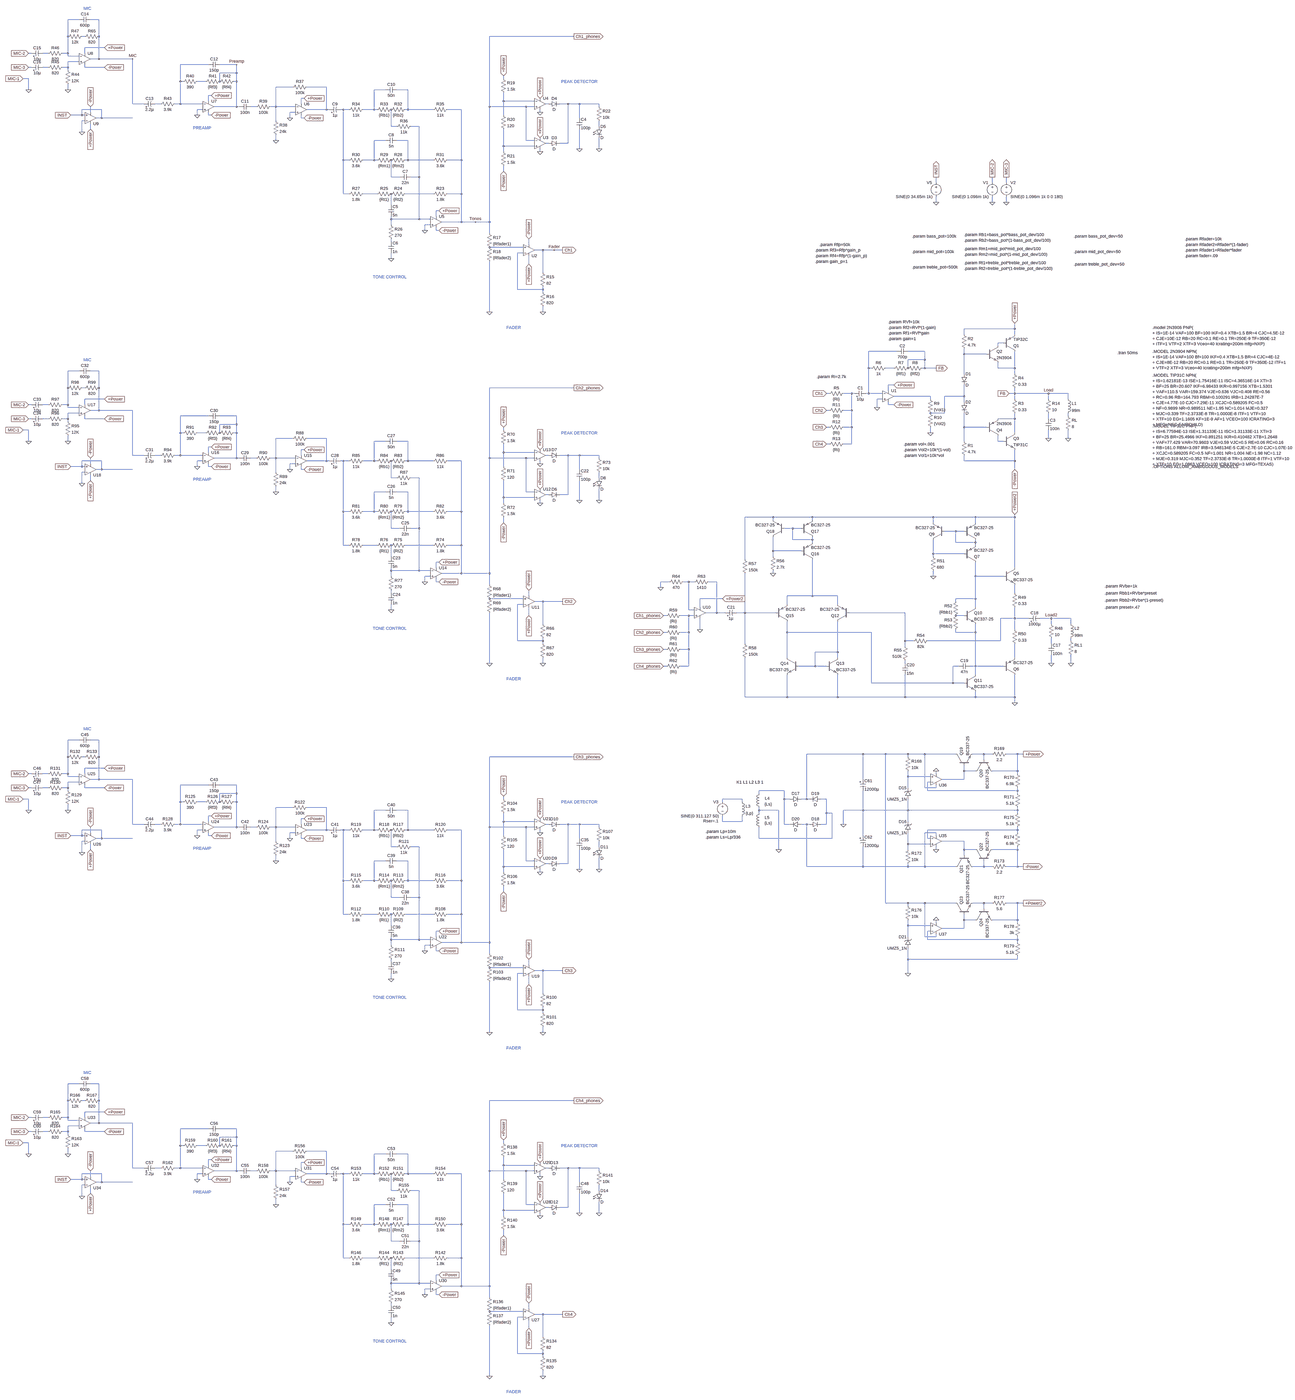
[diagram p0: schematic Project with supply and Zobel.asc, whole sheet]
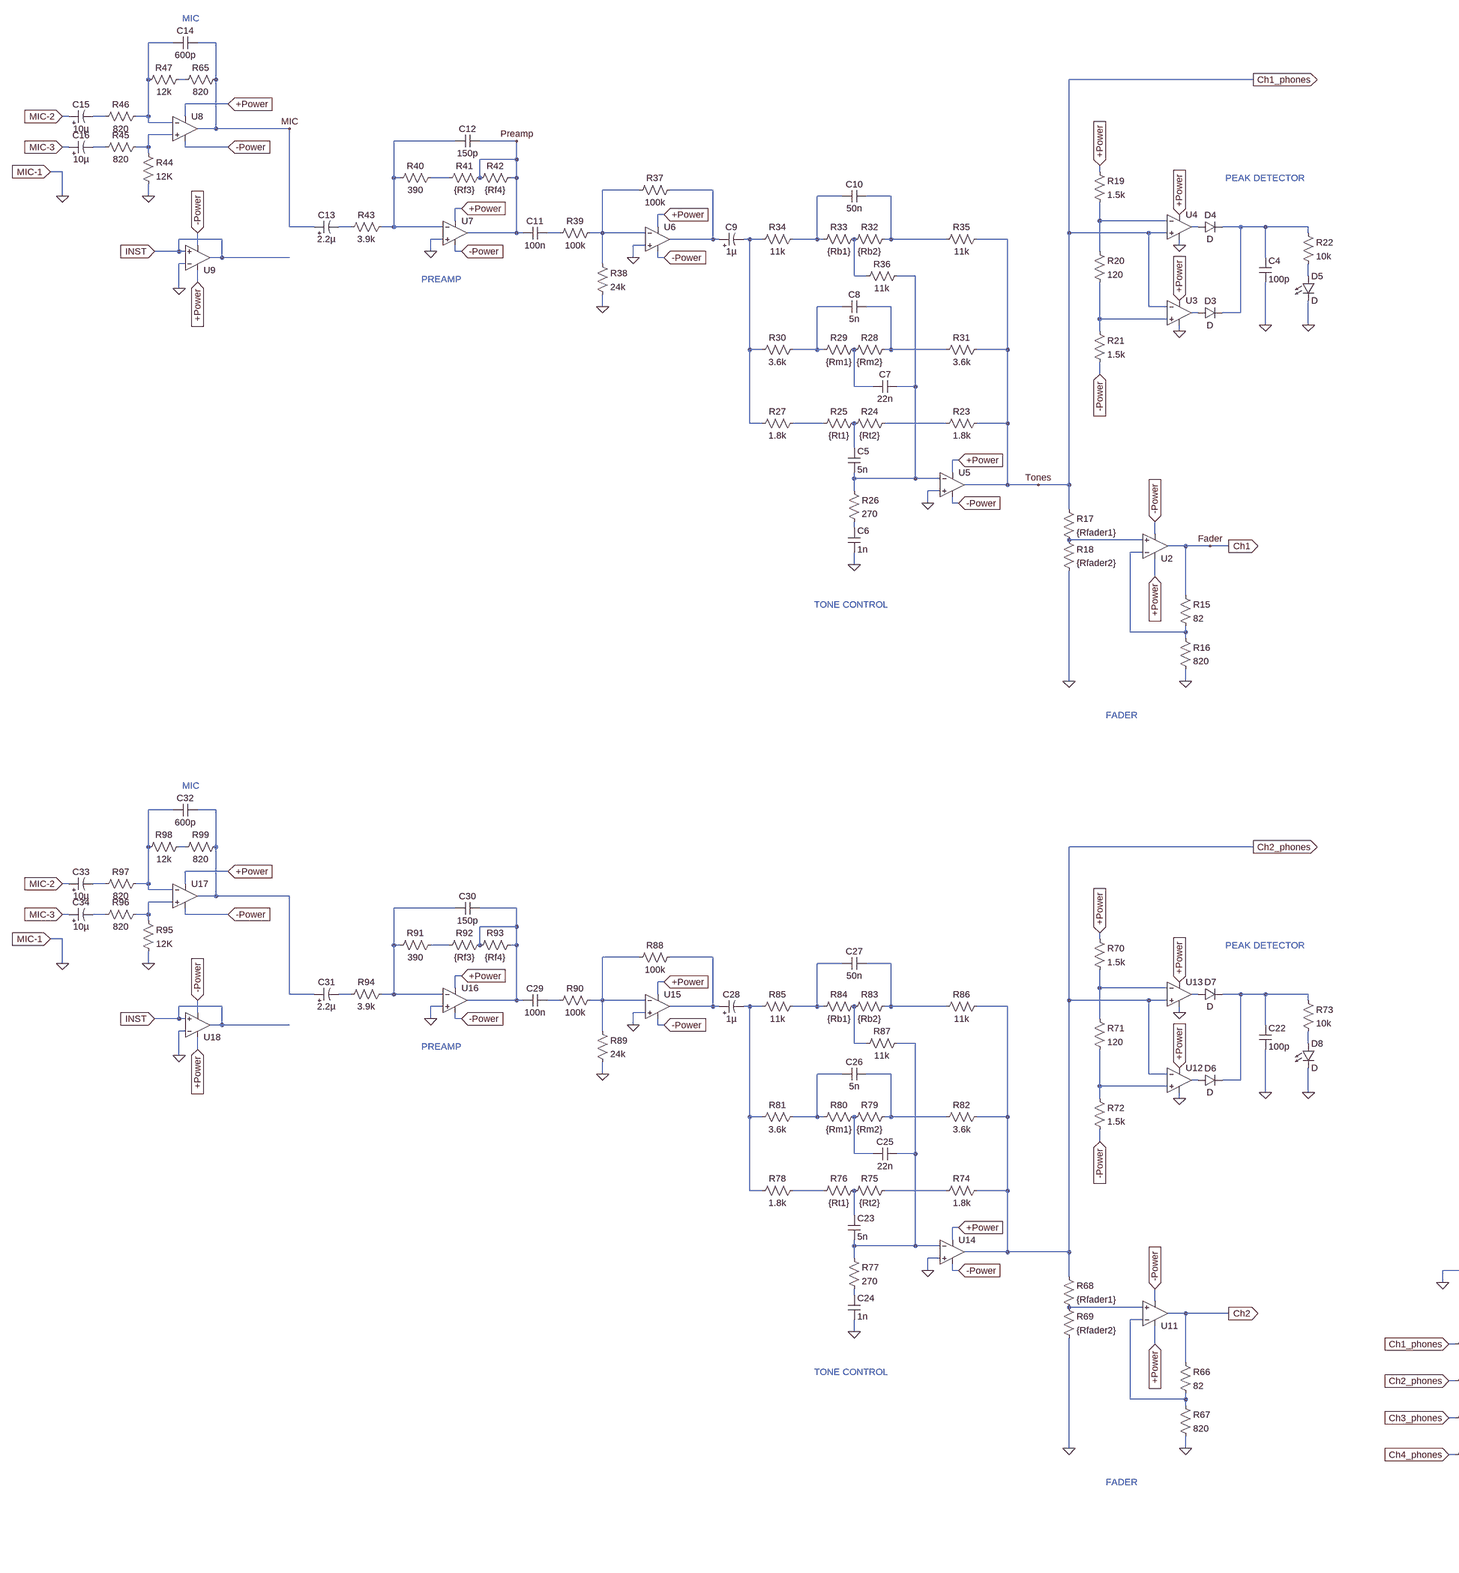
[diagram p1: schematic Project with supply and Zobel.asc, part, row 1 of 2, column 1 of 2]
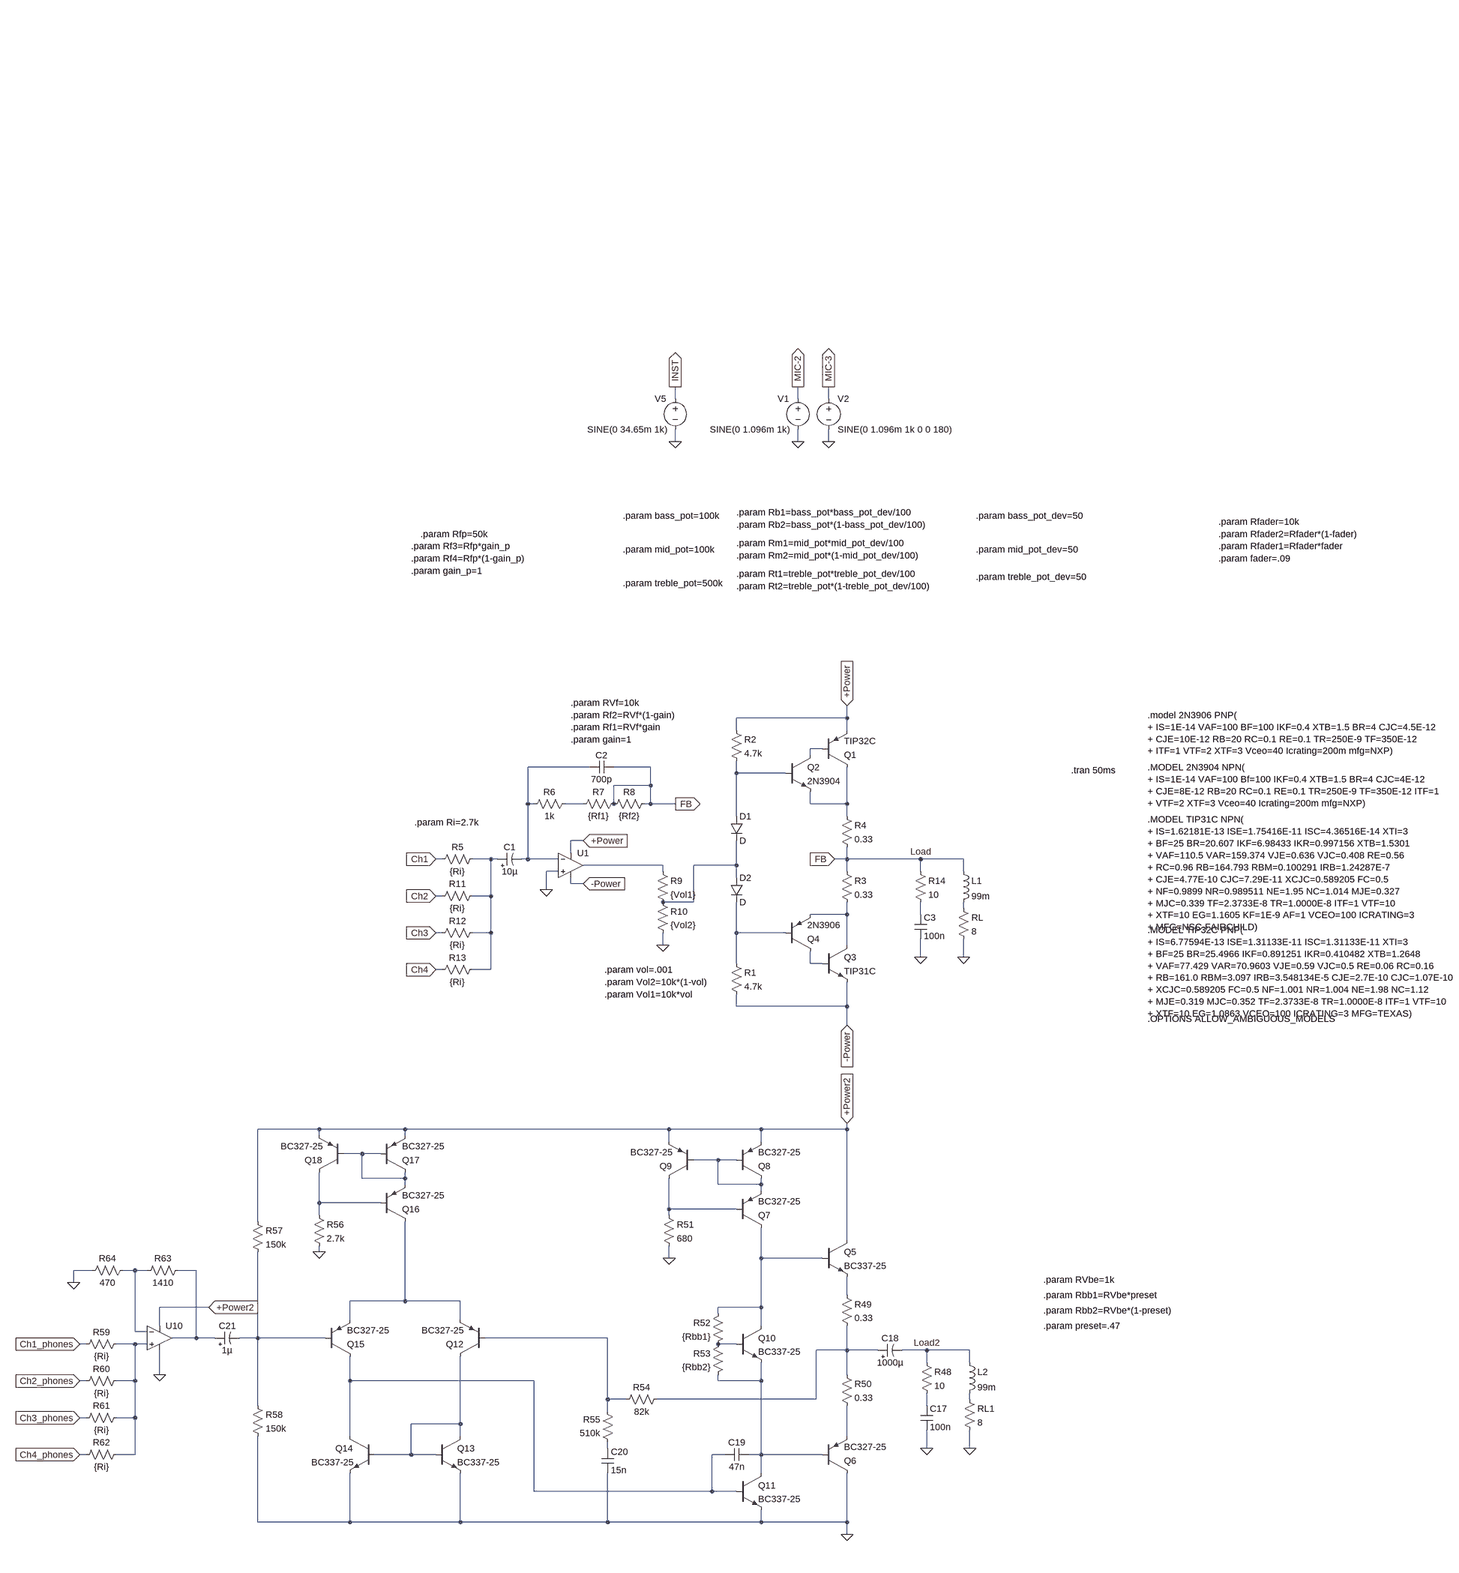
[diagram p2: schematic Project with supply and Zobel.asc, part, row 1 of 2, column 2 of 2]
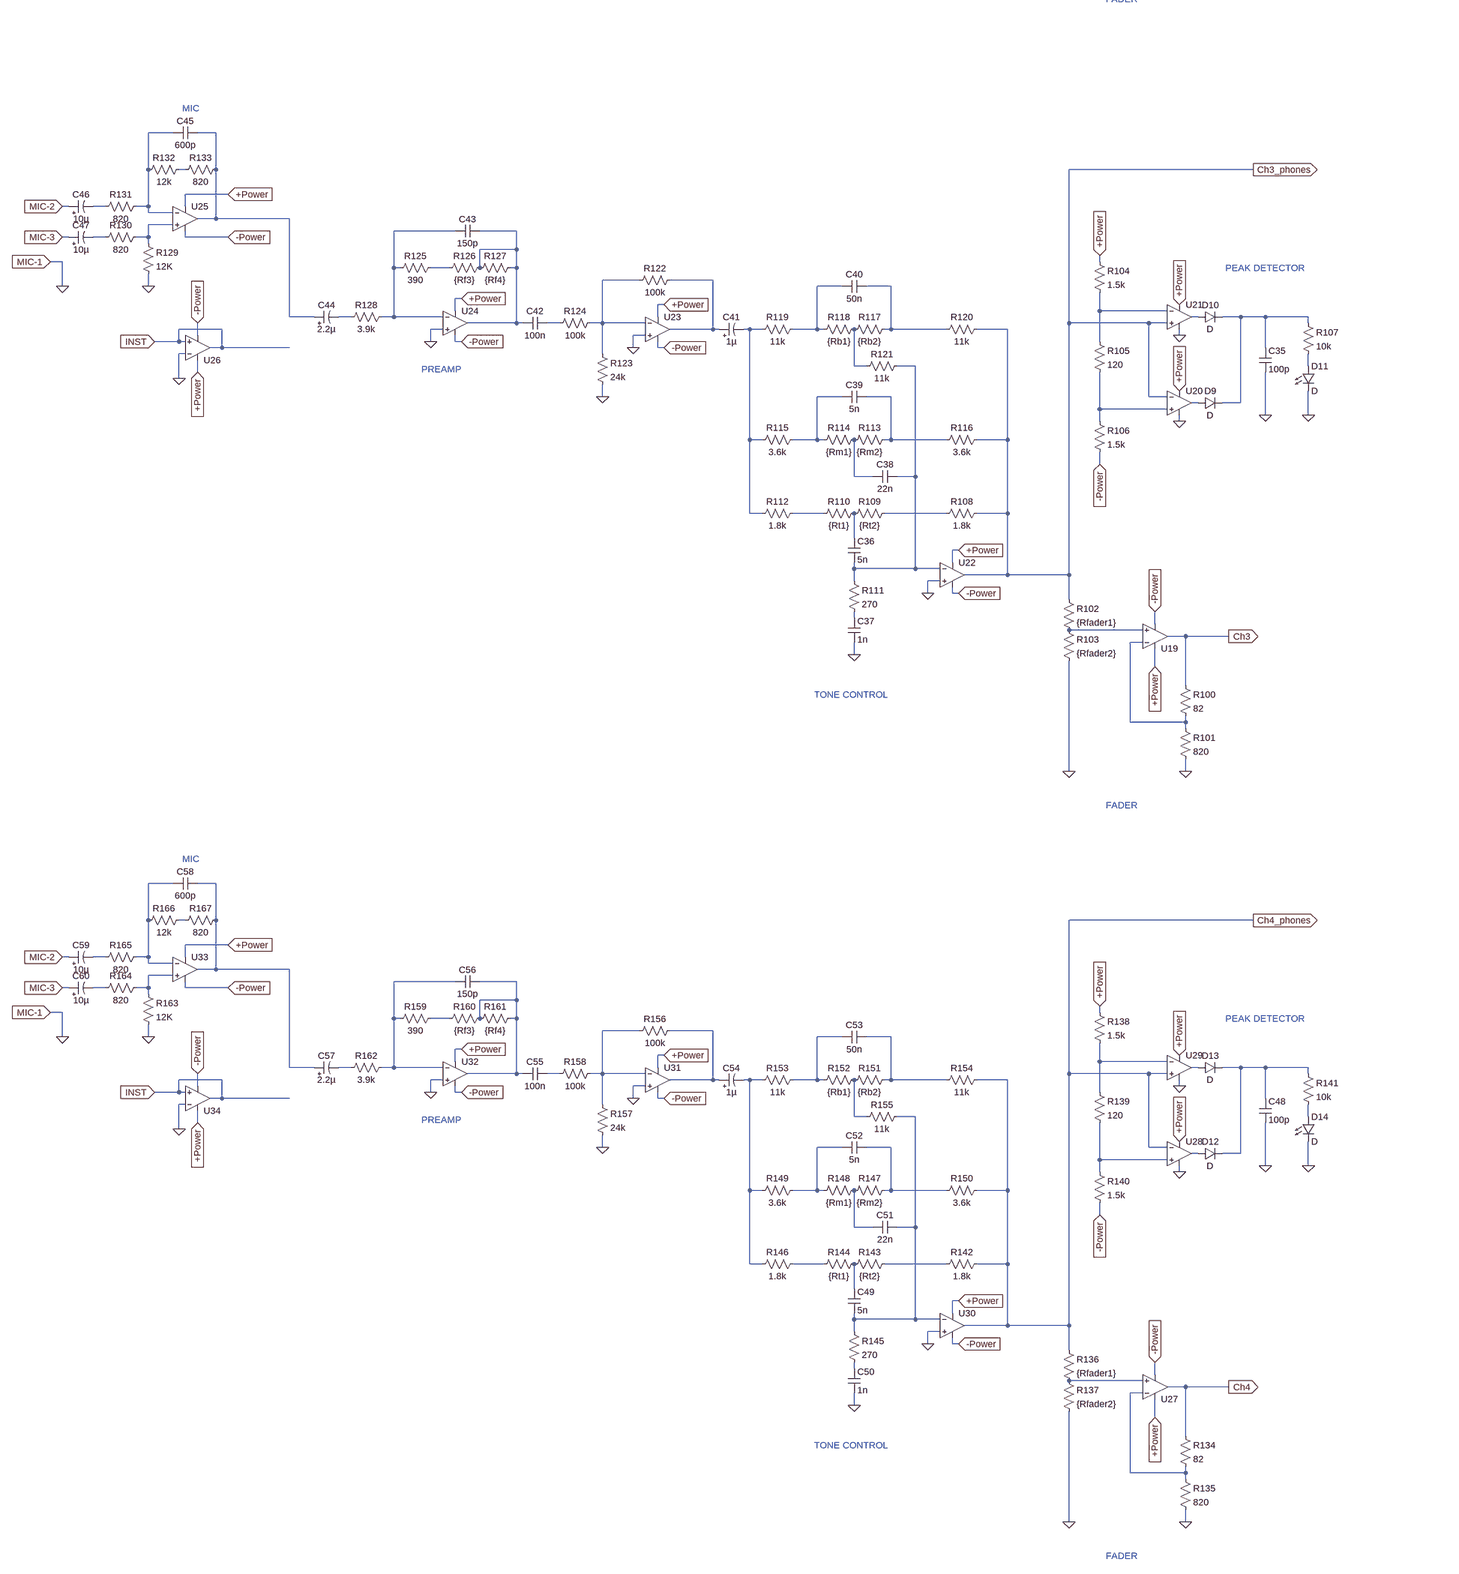
[diagram p3: schematic Project with supply and Zobel.asc, part, row 2 of 2, column 1 of 2]
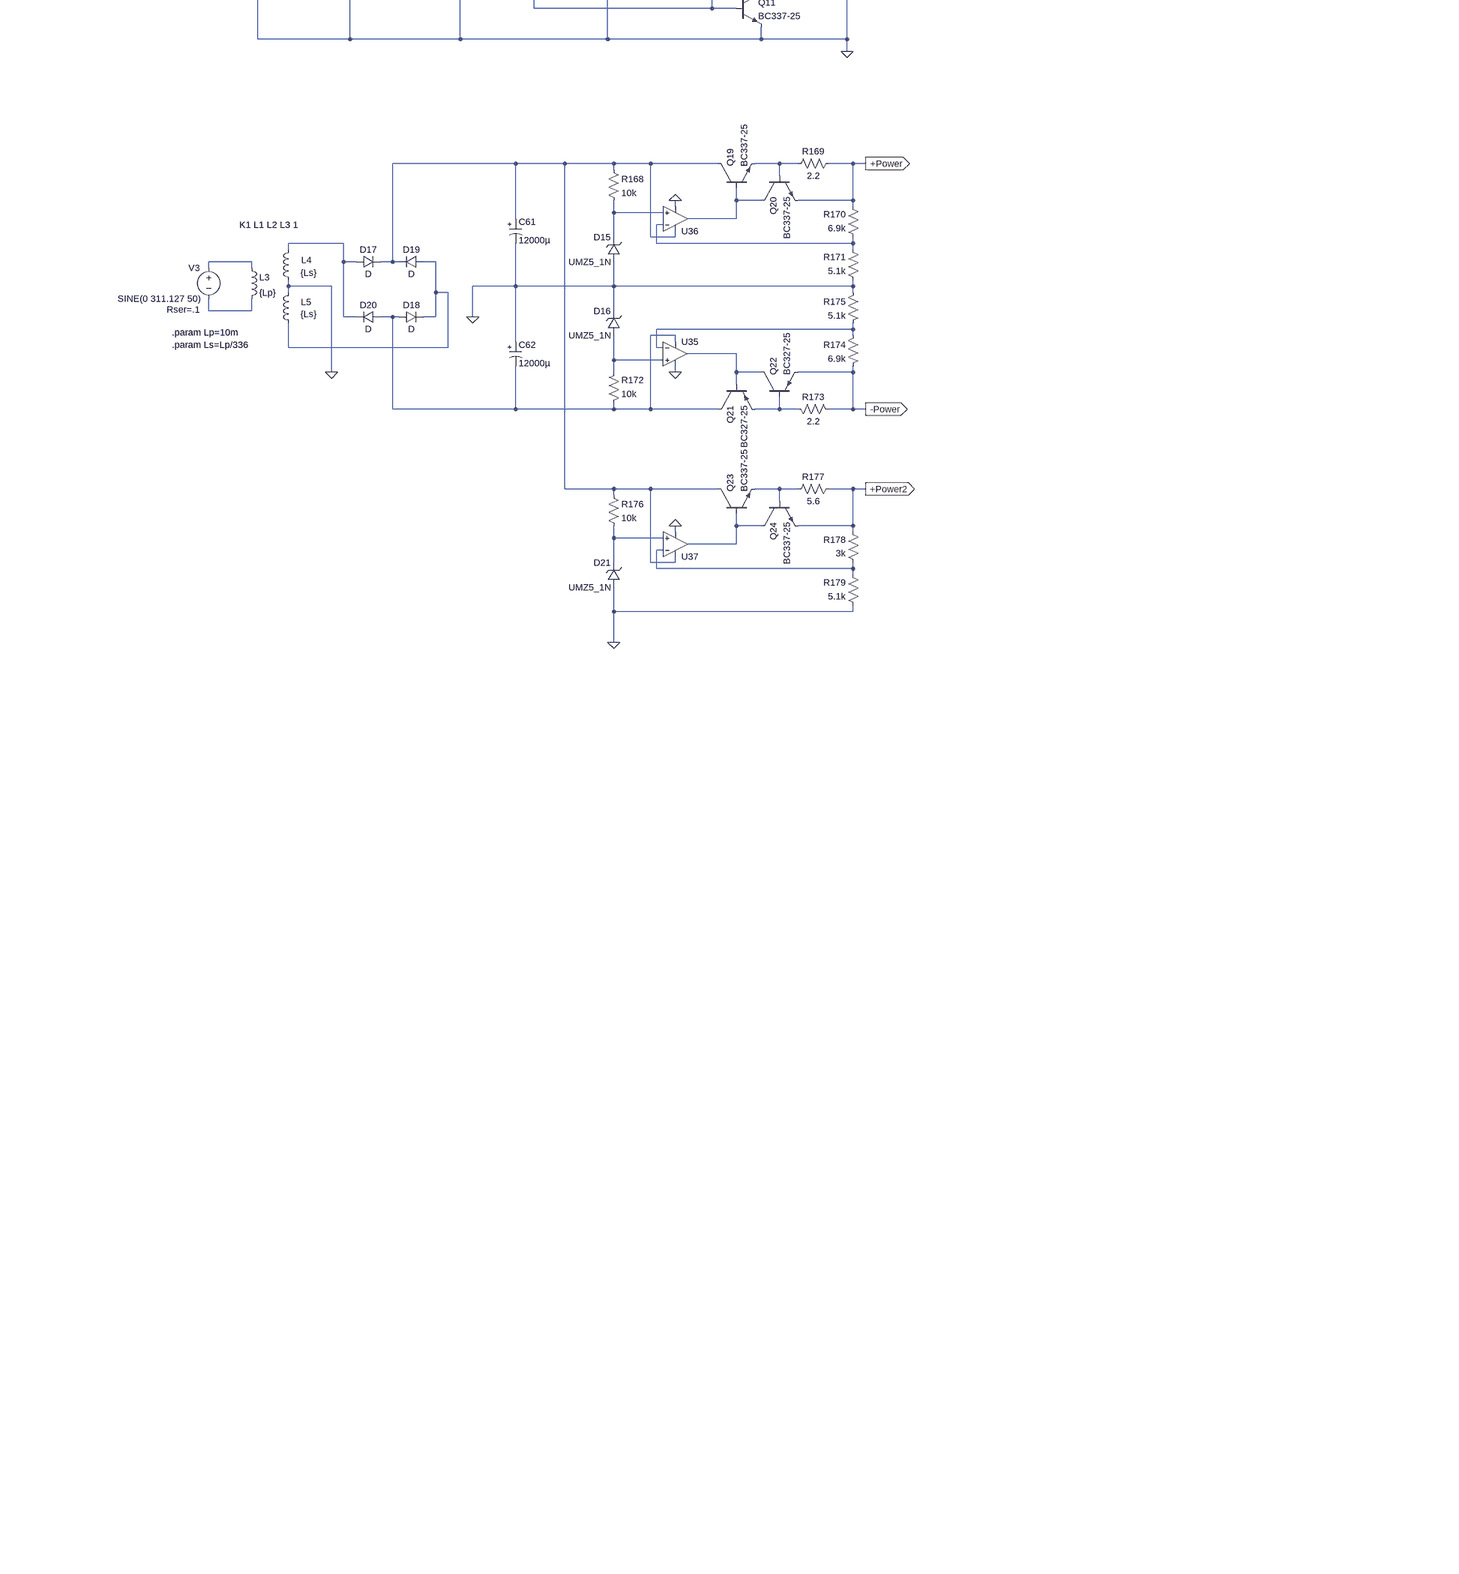
[diagram p4: schematic Project with supply and Zobel.asc, part, row 2 of 2, column 2 of 2]
* Project with supply and Zobel.asc
Q2 N032 N034 N036 0 2N3904
Q3 N049 N057 -Power 0 TIP31C
Q4 N057 N051 N049 0 2N3906
D1 N034 N042 D
D2 N042 N051 D
R2 +Power N034 4.7k
RL N047 0 8
R1 N051 -Power 4.7k
R3 Load N049 0.33
R4 N036 Load 0.33
Q1 N036 N032 +Power 0 TIP32C
X§U1 0 N033 +Power -Power N041 level1 Avol=1Meg GBW=10Meg Vos=0 En=0 Enk=0 In=0 Ink=0 Rin=500Meg  ; pins In+ In- V+ V- OUT
R5 N040 Fader {Ri}
R6 N035 N033 1k
R7 Load N035 {Rf1}
R8 Load Load {Rf2}
R9 N041 N042 {Vol1}
R10 N042 0 {Vol2}
R11 N040 Ch2 {Ri}
R12 N040 Ch3 {Ri}
R13 N040 Ch4 {Ri}
C1 N040 N033 10µ
C2 Load N033 700p
L1 Load N047 99m
R14 Load N050 10
C3 N050 0 100n
X§U2 N030 N031 +Power -Power Fader level1 Avol=1Meg GBW=10Meg Vos=0 En=0 Enk=0 In=0 Ink=0 Rin=500Meg  ; pins In+ In- V+ V- OUT
R15 Fader N031 82
R16 N031 0 820
R17 Tones N030 {Rfader1}
R18 N030 0 {Rfader2}
X§U3 N024 Tones +Power 0 N023 level1 Avol=1Meg GBW=10Meg Vos=0 En=0 Enk=0 In=0 Ink=0 Rin=500Meg  ; pins In+ In- V+ V- OUT
D3 N023 N015 D
X§U4 Tones N012 +Power 0 N014 level1 Avol=1Meg GBW=10Meg Vos=0 En=0 Enk=0 In=0 Ink=0 Rin=500Meg  ; pins In+ In- V+ V- OUT
D4 N014 N015 D
R19 +Power N012 1.5k
R20 N012 N024 120
R21 N024 -Power 1.5k
R22 N015 N020 10k
D5 N020 0 D
X§U5 0 N019 +Power -Power Tones level1 Avol=1Meg GBW=10Meg Vos=0 En=0 Enk=0 In=0 Ink=0 Rin=500Meg  ; pins In+ In- V+ V- OUT
R23 Tones N027 1.8k
R24 N027 N028 {Rt2}
R25 N028 N026 {Rt1}
C5 N028 N019 5n
R26 N019 N029 270
C6 N029 0 1n
R27 N026 N017 1.8k
C7 N019 N025 22n
R28 N022 N025 {Rm2}
R29 N025 N021 {Rm1}
C8 N022 N021 5n
R30 N021 N017 3.6k
R31 Tones N022 3.6k
R32 N011 N018 {Rb2}
R33 N018 N010 {Rb1}
C10 N011 N010 50n
R34 N010 N017 11k
R35 Tones N011 11k
R36 N019 N018 11k
C9 N009 N017 1µ
X§U6 0 N008 +Power -Power N009 level1 Avol=1Meg GBW=10Meg Vos=0 En=0 Enk=0 In=0 Ink=0 Rin=500Meg  ; pins In+ In- V+ V- OUT
R37 N009 N008 100k
R38 N008 0 24k
R39 N008 N016 100k
C11 N016 Preamp 100n
X§U7 0 N005 +Power -Power Preamp level1 Avol=1Meg GBW=10Meg Vos=0 En=0 Enk=0 In=0 Ink=0 Rin=500Meg  ; pins In+ In- V+ V- OUT
R40 N007 N005 390
R41 Preamp N007 {Rf3}
R42 Preamp Preamp {Rf4}
C12 Preamp N005 150p
R43 N005 N013 3.9k
C13 MIC N013 2.2µ
X§U8 N004 N001 +Power -Power MIC level1 Avol=1Meg GBW=10Meg Vos=0 En=0 Enk=0 In=0 Ink=0 Rin=500Meg  ; pins In+ In- V+ V- OUT
R44 N004 0 12K
R45 N004 N006 820
R46 N001 N003 820
C14 MIC N001 600p
C15 MIC-2 N003 10µ
C16 MIC-3 N006 10µ
V1 MIC-2 0 SINE(0 1.096m 1k)
V2 MIC-3 0 SINE(0 1.096m 1k 0 0 180)
X§U9 INST 0 +Power -Power INST level1 Avol=1Meg GBW=10Meg Vos=0 En=0 Enk=0 In=0 Ink=0 Rin=500Meg  ; pins In+ In- V+ V- OUT
V5 INST 0 SINE(0 34.65m 1k)
RL1 N094 0 8
L2 Load2 N094 99m
R48 Load2 N095 10
C17 N095 0 100n
C18 N091 Load2 1000µ
R49 N083 N091 0.33
R50 N091 N097 0.33
Q5 +Power2 N079 N083 0 BC337-25
Q6 0 N093 N097 0 BC327-25
Q7 N079 N077 N073 0 BC327-25
Q8 N073 N073 +Power2 0 BC327-25
Q9 N077 N073 +Power2 0 BC327-25
R51 N077 0 680
Q10 N079 N090 N093 0 BC337-25
R52 N079 N090 {Rbb1}
R53 N090 N093 {Rbb2}
Q11 N093 N092 0 0 BC337-25
C19 N093 N092 47n
R54 N091 N088 82k
R55 N098 N088 510k
C20 N098 0 15n
Q12 N096 N088 N084 0 BC327-25
Q13 N096 N096 0 0 BC337-25
Q14 N092 N096 0 0 BC337-25
Q15 N092 N087 N084 0 BC327-25
Q16 N084 N076 N072 0 BC327-25
Q17 N072 N072 +Power2 0 BC327-25
Q18 N076 N072 +Power2 0 BC327-25
R56 N076 0 2.7k
R57 +Power2 N087 150k
R58 N087 0 150k
X§U10 N089 N080 +Power2 0 N081 level1 Avol=1Meg GBW=10Meg Vos=0 En=0 Enk=0 In=0 Ink=0 Rin=500Meg  ; pins In+ In- V+ V- OUT
R59 N089 Tones {Ri}
R60 N089 Ch2_phones {Ri}
R61 N089 Ch3_phones {Ri}
R62 N089 Ch4_phones {Ri}
C21 N081 N087 1µ
R63 N081 N080 1410
R64 N080 0 470
R47 N002 N001 12k
R65 MIC N002 820
X§U11 N085 N086 +Power -Power Ch2 level1 Avol=1Meg GBW=10Meg Vos=0 En=0 Enk=0 In=0 Ink=0 Rin=500Meg  ; pins In+ In- V+ V- OUT
R66 Ch2 N086 82
R67 N086 0 820
R68 Ch2_phones N085 {Rfader1}
R69 N085 0 {Rfader2}
X§U12 N070 Ch2_phones +Power 0 N069 level1 Avol=1Meg GBW=10Meg Vos=0 En=0 Enk=0 In=0 Ink=0 Rin=500Meg  ; pins In+ In- V+ V- OUT
D6 N069 N061 D
X§U13 Ch2_phones N058 +Power 0 N060 level1 Avol=1Meg GBW=10Meg Vos=0 En=0 Enk=0 In=0 Ink=0 Rin=500Meg  ; pins In+ In- V+ V- OUT
D7 N060 N061 D
R70 +Power N058 1.5k
R71 N058 N070 120
R72 N070 -Power 1.5k
R73 N061 N066 10k
D8 N066 0 D
X§U14 0 N065 +Power -Power Ch2_phones level1 Avol=1Meg GBW=10Meg Vos=0 En=0 Enk=0 In=0 Ink=0 Rin=500Meg  ; pins In+ In- V+ V- OUT
R74 Ch2_phones N075 1.8k
R75 N075 N078 {Rt2}
R76 N078 N074 {Rt1}
C23 N078 N065 5n
R77 N065 N082 270
C24 N082 0 1n
R78 N074 N063 1.8k
C25 N065 N071 22n
R79 N068 N071 {Rm2}
R80 N071 N067 {Rm1}
C26 N068 N067 5n
R81 N067 N063 3.6k
R82 Ch2_phones N068 3.6k
R83 N056 N064 {Rb2}
R84 N064 N055 {Rb1}
C27 N056 N055 50n
R85 N055 N063 11k
R86 Ch2_phones N056 11k
R87 N065 N064 11k
C28 N054 N063 1µ
X§U15 0 N053 +Power -Power N054 level1 Avol=1Meg GBW=10Meg Vos=0 En=0 Enk=0 In=0 Ink=0 Rin=500Meg  ; pins In+ In- V+ V- OUT
R88 N054 N053 100k
R89 N053 0 24k
R90 N053 N062 100k
C29 N062 N046 100n
X§U16 0 N045 +Power -Power N046 level1 Avol=1Meg GBW=10Meg Vos=0 En=0 Enk=0 In=0 Ink=0 Rin=500Meg  ; pins In+ In- V+ V- OUT
R91 N052 N045 390
R92 N046 N052 {Rf3}
R93 N046 N046 {Rf4}
C30 N046 N045 150p
R94 N045 N059 3.9k
C31 N038 N059 2.2µ
X§U17 N044 N037 +Power -Power N038 level1 Avol=1Meg GBW=10Meg Vos=0 En=0 Enk=0 In=0 Ink=0 Rin=500Meg  ; pins In+ In- V+ V- OUT
R95 N044 0 12K
R96 N044 N048 820
R97 N037 N043 820
C32 N038 N037 600p
C33 MIC-2 N043 10µ
C34 MIC-3 N048 10µ
X§U18 INST 0 +Power -Power INST level1 Avol=1Meg GBW=10Meg Vos=0 En=0 Enk=0 In=0 Ink=0 Rin=500Meg  ; pins In+ In- V+ V- OUT
R98 N039 N037 12k
R99 N038 N039 820
X§U19 N148 N149 +Power -Power Ch3 level1 Avol=1Meg GBW=10Meg Vos=0 En=0 Enk=0 In=0 Ink=0 Rin=500Meg  ; pins In+ In- V+ V- OUT
R100 Ch3 N149 82
R101 N149 0 820
R102 Ch3_phones N148 {Rfader1}
R103 N148 0 {Rfader2}
X§U20 N137 Ch3_phones +Power 0 N136 level1 Avol=1Meg GBW=10Meg Vos=0 En=0 Enk=0 In=0 Ink=0 Rin=500Meg  ; pins In+ In- V+ V- OUT
D9 N136 N124 D
X§U21 Ch3_phones N120 +Power 0 N123 level1 Avol=1Meg GBW=10Meg Vos=0 En=0 Enk=0 In=0 Ink=0 Rin=500Meg  ; pins In+ In- V+ V- OUT
D10 N123 N124 D
R104 +Power N120 1.5k
R105 N120 N137 120
R106 N137 -Power 1.5k
R107 N124 N133 10k
D11 N133 0 D
X§U22 0 N132 +Power -Power Ch3_phones level1 Avol=1Meg GBW=10Meg Vos=0 En=0 Enk=0 In=0 Ink=0 Rin=500Meg  ; pins In+ In- V+ V- OUT
R108 Ch3_phones N142 1.8k
R109 N142 N144 {Rt2}
R110 N144 N141 {Rt1}
C36 N144 N132 5n
R111 N132 N147 270
C37 N147 0 1n
R112 N141 N127 1.8k
C38 N132 N139 22n
R113 N135 N139 {Rm2}
R114 N139 N134 {Rm1}
C39 N135 N134 5n
R115 N134 N127 3.6k
R116 Ch3_phones N135 3.6k
R117 N119 N131 {Rb2}
R118 N131 N118 {Rb1}
C40 N119 N118 50n
R119 N118 N127 11k
R120 Ch3_phones N119 11k
R121 N132 N131 11k
C41 N117 N127 1µ
X§U23 0 N116 +Power -Power N117 level1 Avol=1Meg GBW=10Meg Vos=0 En=0 Enk=0 In=0 Ink=0 Rin=500Meg  ; pins In+ In- V+ V- OUT
R122 N117 N116 100k
R123 N116 0 24k
R124 N116 N126 100k
C42 N126 N110 100n
X§U24 0 N109 +Power -Power N110 level1 Avol=1Meg GBW=10Meg Vos=0 En=0 Enk=0 In=0 Ink=0 Rin=500Meg  ; pins In+ In- V+ V- OUT
R125 N115 N109 390
R126 N110 N115 {Rf3}
R127 N110 N110 {Rf4}
C43 N110 N109 150p
R128 N109 N122 3.9k
C44 N100 N122 2.2µ
X§U25 N107 N099 +Power -Power N100 level1 Avol=1Meg GBW=10Meg Vos=0 En=0 Enk=0 In=0 Ink=0 Rin=500Meg  ; pins In+ In- V+ V- OUT
R129 N107 0 12K
R130 N107 N111 820
R131 N099 N105 820
C45 N100 N099 600p
C46 MIC-2 N105 10µ
C47 MIC-3 N111 10µ
X§U26 INST 0 +Power -Power INST level1 Avol=1Meg GBW=10Meg Vos=0 En=0 Enk=0 In=0 Ink=0 Rin=500Meg  ; pins In+ In- V+ V- OUT
R132 N103 N099 12k
R133 N100 N103 820
X§U27 N181 N182 +Power -Power Ch4 level1 Avol=1Meg GBW=10Meg Vos=0 En=0 Enk=0 In=0 Ink=0 Rin=500Meg  ; pins In+ In- V+ V- OUT
R134 Ch4 N182 82
R135 N182 0 820
R136 Ch4_phones N181 {Rfader1}
R137 N181 0 {Rfader2}
X§U28 N175 Ch4_phones +Power 0 N174 level1 Avol=1Meg GBW=10Meg Vos=0 En=0 Enk=0 In=0 Ink=0 Rin=500Meg  ; pins In+ In- V+ V- OUT
D12 N174 N166 D
X§U29 Ch4_phones N163 +Power 0 N165 level1 Avol=1Meg GBW=10Meg Vos=0 En=0 Enk=0 In=0 Ink=0 Rin=500Meg  ; pins In+ In- V+ V- OUT
D13 N165 N166 D
R138 +Power N163 1.5k
R139 N163 N175 120
R140 N175 -Power 1.5k
R141 N166 N171 10k
D14 N171 0 D
X§U30 0 N170 +Power -Power Ch4_phones level1 Avol=1Meg GBW=10Meg Vos=0 En=0 Enk=0 In=0 Ink=0 Rin=500Meg  ; pins In+ In- V+ V- OUT
R142 Ch4_phones N178 1.8k
R143 N178 N179 {Rt2}
R144 N179 N177 {Rt1}
C49 N179 N170 5n
R145 N170 N180 270
C50 N180 0 1n
R146 N177 N168 1.8k
C51 N170 N176 22n
R147 N173 N176 {Rm2}
R148 N176 N172 {Rm1}
C52 N173 N172 5n
R149 N172 N168 3.6k
R150 Ch4_phones N173 3.6k
R151 N162 N169 {Rb2}
R152 N169 N161 {Rb1}
C53 N162 N161 50n
R153 N161 N168 11k
R154 Ch4_phones N162 11k
R155 N170 N169 11k
C54 N160 N168 1µ
X§U31 0 N159 +Power -Power N160 level1 Avol=1Meg GBW=10Meg Vos=0 En=0 Enk=0 In=0 Ink=0 Rin=500Meg  ; pins In+ In- V+ V- OUT
R156 N160 N159 100k
R157 N159 0 24k
R158 N159 N167 100k
C55 N167 N156 100n
X§U32 0 N155 +Power -Power N156 level1 Avol=1Meg GBW=10Meg Vos=0 En=0 Enk=0 In=0 Ink=0 Rin=500Meg  ; pins In+ In- V+ V- OUT
R159 N158 N155 390
R160 N156 N158 {Rf3}
R161 N156 N156 {Rf4}
C56 N156 N155 150p
R162 N155 N164 3.9k
C57 N151 N164 2.2µ
X§U33 N154 N150 +Power -Power N151 level1 Avol=1Meg GBW=10Meg Vos=0 En=0 Enk=0 In=0 Ink=0 Rin=500Meg  ; pins In+ In- V+ V- OUT
R163 N154 0 12K
R164 N154 N157 820
R165 N150 N153 820
C58 N151 N150 600p
C59 MIC-2 N153 10µ
C60 MIC-3 N157 10µ
X§U34 INST 0 +Power -Power INST level1 Avol=1Meg GBW=10Meg Vos=0 En=0 Enk=0 In=0 Ink=0 Rin=500Meg  ; pins In+ In- V+ V- OUT
R166 N152 N150 12k
R167 N151 N152 820
X§U36 N106 N108 N101 0 N104 level1 Avol=1Meg GBW=10Meg Vos=0 En=0 Enk=0 In=0 Ink=0 Rin=500Meg  ; pins In+ In- V+ V- OUT
R168 N101 N106 10k
D15 0 N106 UMZ5_1N
Q19 N101 N104 N102 0 BC337-25
Q20 N104 N102 +Power 0 BC337-25
Q21 N125 N129 N138 0 BC327-25
Q22 N129 N138 -Power 0 BC327-25
R169 +Power N102 2.2
R170 N108 +Power 6.9k
R171 0 N108 5.1k
X§U35 N130 N128 N125 0 N129 level1 Avol=1Meg GBW=10Meg Vos=0 En=0 Enk=0 In=0 Ink=0 Rin=500Meg  ; pins In+ In- V+ V- OUT
R172 N125 N130 10k
D16 N130 0 UMZ5_1N
R173 -Power N138 2.2
R174 N128 -Power 6.9k
R175 0 N128 5.1k
C61 N101 0 12000µ
C62 0 N125 12000µ
D17 N112 N101 D
D18 N125 N114 D
D19 N114 N101 D
D20 N125 N112 D
L3 N113 N121 {Lp}
L4 0 N112 {Ls}
L5 N114 0 {Ls}
V3 N113 N121 SINE(0 311.127 50) Rser=.1
C4 N015 0 100p
C22 N061 0 100p
C35 N124 0 100p
C48 N166 0 100p
X§U37 N145 N146 N101 0 N143 level1 Avol=1Meg GBW=10Meg Vos=0 En=0 Enk=0 In=0 Ink=0 Rin=500Meg  ; pins In+ In- V+ V- OUT
R176 N101 N145 10k
D21 0 N145 UMZ5_1N
Q23 N101 N143 N140 0 BC337-25
Q24 N143 N140 +Power2 0 BC337-25
R177 +Power2 N140 5.6
R178 N146 +Power2 3k
R179 0 N146 5.1k
.model D D
.lib standard.dio
.model NPN NPN
.model PNP PNP
.lib standard.bjt
.tran 50ms
.MODEL 2N3904 NPN(
+ IS=1E-14 VAF=100 Bf=100 IKF=0.4 XTB=1.5 BR=4 CJC=4E-12
+ CJE=8E-12 RB=20 RC=0.1 RE=0.1 TR=250E-9 TF=350E-12 ITF=1
+ VTF=2 XTF=3 Vceo=40 Icrating=200m mfg=NXP)
.MODEL TIP31C NPN(
+ IS=1.62181E-13 ISE=1.75416E-11 ISC=4.36516E-14 XTI=3
+ BF=25 BR=20.607 IKF=6.98433 IKR=0.997156 XTB=1.5301
+ VAF=110.5 VAR=159.374 VJE=0.636 VJC=0.408 RE=0.56
+ RC=0.96 RB=164.793 RBM=0.100291 IRB=1.24287E-7
+ CJE=4.77E-10 CJC=7.29E-11 XCJC=0.589205 FC=0.5
+ NF=0.9899 NR=0.989511 NE=1.95 NC=1.014 MJE=0.327
+ MJC=0.339 TF=2.3733E-8 TR=1.0000E-8 ITF=1 VTF=10
+ XTF=10 EG=1.1605 KF=1E-9 AF=1 VCEO=100 ICRATING=3
+ MFG=NSC-FAIRCHILD)
.model 2N3906 PNP(
+ IS=1E-14 VAF=100 BF=100 IKF=0.4 XTB=1.5 BR=4 CJC=4.5E-12
+ CJE=10E-12 RB=20 RC=0.1 RE=0.1 TR=250E-9 TF=350E-12
+ ITF=1 VTF=2 XTF=3 Vceo=40 Icrating=200m mfg=NXP)
.MODEL TIP32C PNP(
+ IS=6.77594E-13 ISE=1.31133E-11 ISC=1.31133E-11 XTI=3
+ BF=25 BR=25.4966 IKF=0.891251 IKR=0.410482 XTB=1.2648
+ VAF=77.429 VAR=70.9603 VJE=0.59 VJC=0.5 RE=0.06 RC=0.16
+ RB=161.0 RBM=3.097 IRB=3.548134E-5 CJE=2.7E-10 CJC=1.07E-10
+ XCJC=0.589205 FC=0.5 NF=1.001 NR=1.004 NE=1.98 NC=1.12
+ MJE=0.319 MJC=0.352 TF=2.3733E-8 TR=1.0000E-8 ITF=1 VTF=10
+ XTF=10 EG=1.0863 VCEO=100 ICRATING=3 MFG=TEXAS)
.param vol=.001
.param gain=1
.param Rf1=RVf*gain
.param Rf2=RVf*(1-gain)
.param Vol1=10k*vol
.param Vol2=10k*(1-vol)
.OPTIONS ALLOW_AMBIGUOUS_MODELS
.param RVf=10k
.param Ri=2.7k
.param fader=.09
.param Rfader1=Rfader*fader
.param Rfader2=Rfader*(1-fader)
.param Rfader=10k
.param Rb1=bass_pot*bass_pot_dev/100
.param Rb2=bass_pot*(1-bass_pot_dev/100)
.param Rm1=mid_pot*mid_pot_dev/100
.param Rm2=mid_pot*(1-mid_pot_dev/100)
.param Rt1=treble_pot*treble_pot_dev/100
.param Rt2=treble_pot*(1-treble_pot_dev/100)
.param bass_pot=100k
.param mid_pot=100k
.param treble_pot=500k
.param bass_pot_dev=50
.param mid_pot_dev=50
.param treble_pot_dev=50
.param Rfp=50k
.param Rf3=Rfp*gain_p
.param Rf4=Rfp*(1-gain_p)
.param gain_p=1
* MIC
* PREAMP
* TONE CONTROL
* FADER
* PEAK DETECTOR
.param RVbe=1k
.param Rbb1=RVbe*preset
.param Rbb2=RVbe*(1-preset)
.param preset=.47
* MIC
* PREAMP
* TONE CONTROL
* FADER
* PEAK DETECTOR
* MIC
* PREAMP
* TONE CONTROL
* FADER
* PEAK DETECTOR
* MIC
* PREAMP
* TONE CONTROL
* FADER
* PEAK DETECTOR
K1 L1 L2 L3 1
.param Lp=10m
.param Ls=Lp/336
.lib UniversalOpAmp1.lib
.backanno
.end